# Altium schematic sheet Peripheral.SchDoc
size A4; DocumentNumber: 2; SheetNumber: 2; SheetTotal: 4
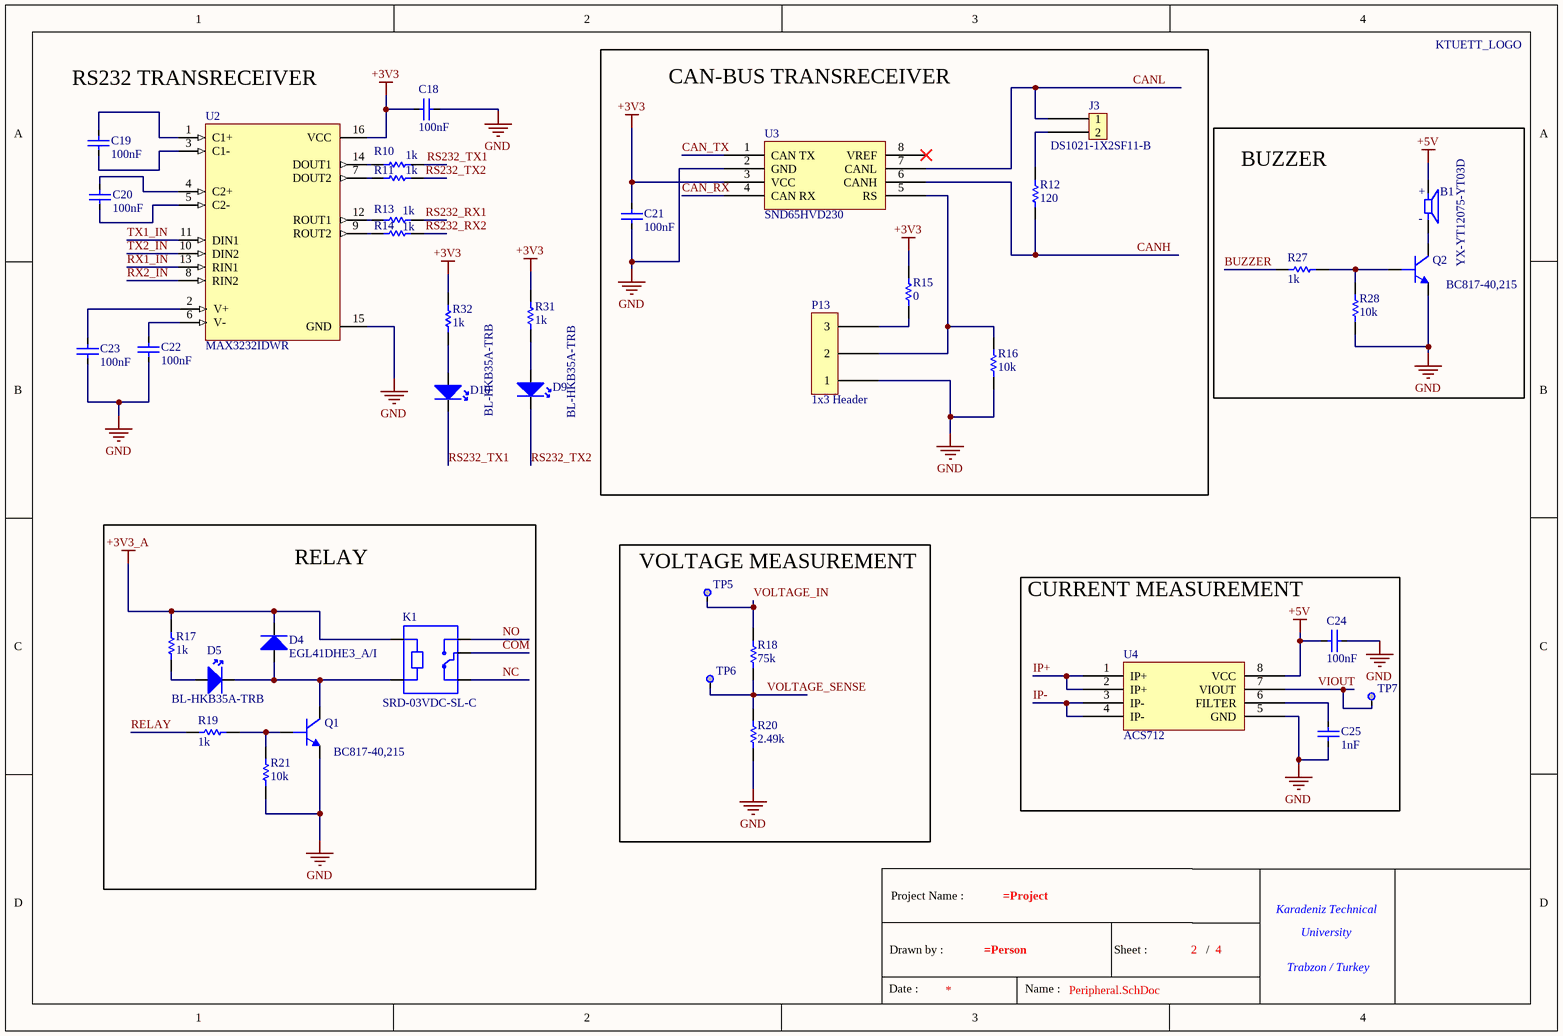
[diagram p0: Peripheral.SchDoc]

## Parts
1  KTUETT_LOGO  [KTUETT_LOGO]  (value not drawn)  (no BOM)
*  Title Block  (value not drawn)  (graphical)
B1  YX-YT12075-YT03D  [BUZZER]
C18  100nF  [CAP-0603]
C19  100nF  [CAP-0603]
C20  100nF  [CAP-0603]
C21  100nF  [CAP-0603]
C22  100nF  [CAP-0603]
C23  100nF  [CAP-0603]
C24  100nF  [CAP-0603]
C25  1nF  [CAP-0603]
D4  EGL41DHE3_A/I  [DO-213AB]
D5  BL-HKB35A-TRB  [LED-0805]
D9  BL-HKB35A-TRB  [LED-0805]
D10  BL-HKB35A-TRB  [LED-0805]
J3  DS1021-1X2SF11-B  [1x2 HEADER]
K1  SRD-03VDC-SL-C  [RELAY]
P13  1x3 Header  [1x3 Header (2.54 mm)]
Q1  BC817-40,215  [SOT23-3]
Q2  BC817-40,215  [SOT23-3]
R10  1k  [RES-0603]
R11  1k  [RES-0603]
R12  120  [RES-0603]
R13  1k  [RES-0603]
R14  1k  [RES-0603]
R15  0  [RES-0603]
R16  10k  [RES-0603]
R17  1k  [RES-0603]
R18  75k  [RES-0603]
R19  1k  [RES-0603]
R20  2.49k  [RES-0603]
R21  10k  [RES-0603]
R27  1k  [RES-0603]
R28  10k  [RES-0603]
R31  1k  [RES-0603]
R32  1k  [RES-0603]
TP5  Test Point  [0.8mm Test Point]  (value not drawn)  (no BOM)
TP6  Test Point  [0.8mm Test Point]  (value not drawn)  (no BOM)
TP7  Test Point  [0.8mm Test Point]  (value not drawn)  (no BOM)
U2  MAX3232IDWR  [SOIC-16]
U3  SND65HVD230  [SOIC-8]
U4  ACS712  [SOIC-8]

## Blocks framed on the sheet
CAN-BUS TRANSRECEIVER: C21 J3 P13 R12 R15 R16 U3
BUZZER: B1 Q2 R27 R28
RELAY: D4 D5 K1 Q1 R17 R19 R21
VOLTAGE MEASUREMENT: R18 R20 TP5 TP6
CURRENT MEASUREMENT: C24 C25 TP7 U4

## Nets
+3V3: C18.2 C21.1 R15.2 R31.2 R32.2 U2.16(VCC) U3.3(VCC)
+3V3_A: D4.2(K) K1.A1 R17.1
+5V: B1.P C24.1 U4.8(VCC)
GND: C18.1 C21.2 C22.2 C23.2 C24.2 C25.1 P13.1 Q1.2(E) Q2.2(E) R16.1 R20.1 R21.1 R28.1 U2.15(GND) U3.2(GND) U4.5(GND)
BUZZER: R27.2
CAN_RX: U3.4(CAN_RX)
CAN_TX: U3.1(CAN_TX)
CANH: R12.2 U3.6(CANH)
CANL: J3.1 U3.7(CANL)
COM: K1.COM
IP+: U4.1(IP+) U4.2(IP+)
IP-: U4.3(IP-) U4.4(IP-)
NC: K1.NC
NO: K1.NO
RELAY: R19.2
RS232_RX1: R13.1
RS232_RX2: R14.1
RS232_TX1: D10.2(K) R10.1
RS232_TX2: D9.2(K) R11.1
RX1_IN: U2.13(RIN1)
RX2_IN: U2.8(RIN2)
TX1_IN: U2.11(DIN1)
TX2_IN: U2.10(DIN2)
VIOUT: TP7.1 U4.7(VIOUT)
VOLTAGE_IN: R18.1 TP5.1
VOLTAGE_SENSE: R18.2 R20.2 TP6.1
NetB1_N: B1.N Q2.3(C)
NetC19_1: C19.1 U2.1(C1+)
NetC19_2: C19.2 U2.3(C1-)
NetC20_1: C20.1 U2.4(C2+)
NetC20_2: C20.2 U2.5(C2-)
NetC22_1: C22.1 U2.6(V-)
NetC23_1: C23.1 U2.2(V+)
NetC25_2: C25.2 U4.6(FILTER)
NetD4_1: D4.1(A) D5.2(K) K1.A2 Q1.3(C)
NetD5_1: D5.1(A) R17.2
NetD9_1: D9.1(A) R31.1
NetD10_1: D10.1(A) R32.1
NetJ3_2: J3.2 R12.1
NetP13_2: P13.2 R16.2 U3.5(RS)
NetP13_3: P13.3 R15.1
NetQ1_1: Q1.1(B) R19.1 R21.2
NetQ2_1: Q2.1(B) R27.1 R28.2
NetR10_2: R10.2 U2.14(DOUT1)
NetR11_2: R11.2 U2.7(DOUT2)
NetR13_2: R13.2 U2.12(ROUT1)
NetR14_2: R14.2 U2.9(ROUT2)

Not connected (* = marked no-connect by the designer): U3 8(VREF)*

## Notes on the sheet
- RS232 TRANSRECEIVER
- (in symbol Title Block) Project Name :; Karadeniz Technical; University; Drawn by :; Sheet :; /; Trabzon / Turkey; Date :; Name :
- (in symbol YX-YT12075-YT03D) +; -

## Library data of the parts
1 = KTUETT_LOGO: Library Reference: Miscellaneous; Component Type: LOGO
* = Title Block: Standart Title Block
B1 = YX-YT12075-YT03D: Manufacturer: YXDZ; Voltage: 3V; Component Type: Buzzer; Man Code: YX-YT12075-YT03D; Mounting Type: THT; Dimensions(mm): 12.00X7.50
C18-C24 = CGA3E2X7R1H104K080AA: Manufacturer: TDK; Temperature Coefficient: X7R; Voltage: 50V; Library Reference: Capacitor; Tolerance: %10; Man Code: CGA3E2X7R1H104K080AA; Value: 100nF; Footprint: 0603; Component Type: Ceramic Capacitor
C25 = C0603C102F5GACTU: Manufacturer: KEMET; Tolerance: %1; Voltage: 50V; Value: 1nF; Footprint: 0603; Component Type: Chip Capacitor; Man Code: C0603C102F5GACTU
D4 = EGL41DHE3_A/I: Manufacturer: VISHAY; Current: 1A; Voltage: 200; Component Type: Diode; Man Code: EGL41DHE3_A/I
D5 D9 D10 = BL-HKB35A-TRB: Manufacturer: BRIGHT LED; Colour: Yellow; Vf: 2.2V; Library Reference: Miscellaneous; Luminous Intensity: 94mcd; If: 20mA; Lens Transparency: Water Clear; Man Code: BL-HKB35A-TRB; Footprint: 0805; Component Type: Led
J3 = DS1021-1X2SF11-B: Manufacturer: KLS Electronic; Number of Row: 1; Pitch: 2.54mm; Component Type: Header; Man Code: DS1021-1X2SF11-B; Number of Pins: 2
K1 = SRD-03VDC-SL-C: Manufacturer: Songle; Coil Voltage: 3V; Contact Rating Current: 10A; Component Type: Relay; Man Code: SRD-03VDC-SL-C
P13 = 1x3 Header: Contact Number: 3; Gender: Male; Mounting Angle: 180; Number of Row: 1; Pitch: 2.54 mm; Component Type: Connector; Footprint: *; Library Reference: *; Man Code: 1x3 Header; Mounting Style: THT
Q1 Q2 = BC817-40,215: Library Reference: Transistor; Ic(max): 500mA; VCE(max): 45V; Man Code: BC817-40,215; Component Type: NPN
R10 R11 R13 R14 R17 R19 R27 R31 R32 = CRCW06031K00FKEAC: Manufacturer: Vishay; Library Reference: Resistor; Tolerance: %1; Power: 0.1W; Man Code: CRCW06031K00FKEAC; Footprint: 0603; Component Type: Chip Resistor; Value: 1k
R12 = RC0603FR-07120RL: Manufacturer: YAGEO; Compnenet Type: Chip Resistor; Tolerance: %1; Voltage: 75V; Man Code: RC0603FR-07120RL; Value: 120; Footprint: 0603
R15 = 0603SAJ0000T5E: Manufacturer: ROYALOHM; Tolerance: %5; Voltage: 75V; Component Type: Chip Resistor; Value: 0; Man Code: 0603SAJ0000T5E; Footprint: 0603
R16 R21 R28 = CRCW060310K0FKEA: Manufacturer: Vishay; Tolerance: %1; Power: 0.1W; Library Reference: Resistor; Man Code: CRCW060310K0FKEA; Value: 10k; Footprint: 0603; Component Type: Chip Resistor
R18 = ERJ-3EKF7502V: Manufacturer: Panasonic; Library Reference: Resistor; Tolerance: %1; Power: 0.1W; Man Code: ERJ-3EKF7502V; Footprint: 0603; Component Type: Chip Resistor; Value: 75k
R20 = CRCW06032K49FKEB: Manufacturer: Vishay; Tolerance: %1; Power: 0.1W; Library Reference: Resistor; Man Code: CRCW06032K49FKEB; Value: 2.49k; Footprint: 0603; Component Type: Chip Resistor
TP5-TP7 = Test Point: Library Reference: Miscellaneous; Component Type: Test Point
U2 = MAX3232IDWR: Manufacturer: Texas; Supply Voltage: 3V to 5V; Data Rate: 250kbps; Man Code: MAX3232IDWR; Component Type: IC Driver
U3 = SND65HVD230: Manufacturer: TI; Man Code: SN65HVD230; Component Type: CAN-BUS Transreceiver
U4 = ACS712: Manufacturer: Allegro; Supply Voltage: 5V; Component Type: Hall Effect Sensor; Man Code: ACS712